# EAGLE design CAP-SENSE-SLIM (EAGLE 9.6.2)
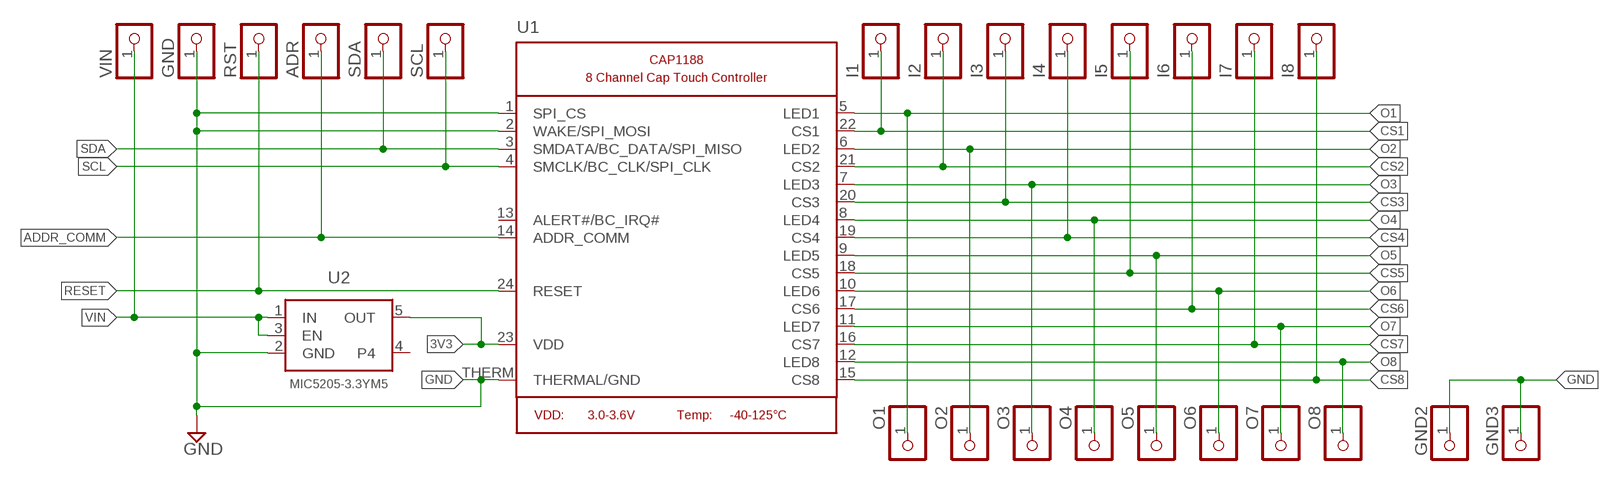
[diagram p0: schematic, sheet 1]

## Parts
ADR  PINHD-1X1CB  [1X01-CLEANBIG]
GND  PINHD-1X1CB  [1X01-CLEANBIG]
GND2  PINHD-1X1CB  [1X01-CLEANBIG]
GND3  PINHD-1X1CB  [1X01-CLEANBIG]
I1  PINHD-1X1CB  [1X01-CLEANBIG]
I2  PINHD-1X1CB  [1X01-CLEANBIG]
I3  PINHD-1X1CB  [1X01-CLEANBIG]
I4  PINHD-1X1CB  [1X01-CLEANBIG]
I5  PINHD-1X1CB  [1X01-CLEANBIG]
I6  PINHD-1X1CB  [1X01-CLEANBIG]
I7  PINHD-1X1CB  [1X01-CLEANBIG]
I8  PINHD-1X1CB  [1X01-CLEANBIG]
O1  PINHD-1X1CB  [1X01-CLEANBIG]
O2  PINHD-1X1CB  [1X01-CLEANBIG]
O3  PINHD-1X1CB  [1X01-CLEANBIG]
O4  PINHD-1X1CB  [1X01-CLEANBIG]
O5  PINHD-1X1CB  [1X01-CLEANBIG]
O6  PINHD-1X1CB  [1X01-CLEANBIG]
O7  PINHD-1X1CB  [1X01-CLEANBIG]
O8  PINHD-1X1CB  [1X01-CLEANBIG]
RST  PINHD-1X1CB  [1X01-CLEANBIG]
SCL  PINHD-1X1CB  [1X01-CLEANBIG]
SDA  PINHD-1X1CB  [1X01-CLEANBIG]
U1  MICROBUILDER_CAP1188  [MICROBUILDER_QFN24_4MM_SMSC]
U2  MIC5205-3.3YM5  MICROBUILDER_VREG_SOT23-5  [MICROBUILDER_SOT23-5]
VIN  PINHD-1X1CB  [1X01-CLEANBIG]

## Nets
3V3 [8 mil]: U1.23(VDD) U2.5(OUT)
ADDR_COMM [8 mil]: ADR.1 U1.14(ADDR_COMM)
CS1 [8 mil]: I1.1 U1.22(CS1)
CS2 [8 mil]: I2.1 U1.21(CS2)
CS3 [8 mil]: I3.1 U1.20(CS3)
CS4 [8 mil]: I4.1 U1.19(CS4)
CS5 [8 mil]: I5.1 U1.18(CS5)
CS6 [8 mil]: I6.1 U1.17(CS6)
CS7 [8 mil]: I7.1 U1.16(CS7)
CS8 [8 mil]: I8.1 U1.15(CS8)
GND [8 mil]: GND2.1 GND3.1 GND.1 U1.1(SPI_CS) U1.2(WAKE/SPI_MOSI) U1.THERM(THERMAL/GND) U2.2(GND)
O1 [8 mil]: O1.1 U1.5(LED1)
O2 [8 mil]: O2.1 U1.6(LED2)
O3 [8 mil]: O3.1 U1.7(LED3)
O4 [8 mil]: O4.1 U1.8(LED4)
O5 [8 mil]: O5.1 U1.9(LED5)
O6 [8 mil]: O6.1 U1.10(LED6)
O7 [8 mil]: O7.1 U1.11(LED7)
O8 [8 mil]: O8.1 U1.12(LED8)
RESET [8 mil]: RST.1 U1.24(RESET)
SCL [8 mil]: SCL.1 U1.4(SMCLK/BC_CLK/SPI_CLK)
SDA [8 mil]: SDA.1 U1.3(SMDATA/BC_DATA/SPI_MISO)
VIN [8 mil]: U2.1(IN) U2.3(EN) VIN.1
Unconnected: U1.13(ALERT#/BC_IRQ#) U2.4

## Library data of the parts
ADR GND GND2 GND3 I1-I8 O1-O8 RST SCL SDA VIN = adafruit:PINHD-1X1: Pin header 1x1 for 0.1" spacing With round pins
U1 = Adafruit CAP1188:MICROBUILDER_CAP1188: CAP1188 - Eight Channel Cap Touch Controller
U2 = Adafruit CAP1188:MICROBUILDER_VREG_SOT23-5: SOT23-5 Fixed Voltage Regulators Part Current Out V Out V In V Dropout θJA (°C/W) TJ (°C) Digikey Part No. ADP121 150mA 3.3V 3.4-5.5V 0.09V @ 150mA -- -- ADP121-AUJZ33R7CT-ND ADP121 150mA 3.0V 3.1-5.5V 0.09V @ 150mA -- -- ADP121-AUJZ30R7CT-ND ADP122 300mA 3.3V 3.4-5.5V 0.085V @ 300mA -- -- ADP122AUJZ-3.3-R7CT-ND ADP1712 300mA 3.3V 3.5-5.5V 0.17V @ 300mA -- -- ADP1712AUJZ-3.3-R7TR-ND AP7311 (Low Cost) 150mA 3.3V 3.5-6V 0.15V @ 150mA -- -- AP7311-33WG-7DICT-ND LD39015M18R 150mA 1.8V 1.9V-5.5V 0.08V @ 100mA -- -- 497-6977-1-ND LP2985A-33DBVR 150mA 3.3V 3.3-16V 0.28V @ 150mA 206 150 296-18479-1-ND MCP1824T-3302E/OT 300mA 3.3V 3.5V-6V 0.2V @ 300mA -- -- MCP1824T-3302E/OTCT-ND MIC5205-2.5YM5 TR 150mA 2.5V 2.7-16V 0.165V @ 150mA -- -- 576-1257-2-ND MIC5205-3.0YM5 TR 150mA 3.0V 3.2V-16V 0.165V @ 150mA -- -- 576-1258-2-ND MIC5205-3.3YM5 TR 150mA 3.3V 3.5V-16V 0.165V @ 150mA -- -- 576-1259-2-ND TPS780330220 150mA 3.3V+2.2V 3.6-5.5V 250mV Max -- -- 296-23332-1-ND TDA3663/N1,135 100mA 3.3V 3.5-45V 0.18V @ 50mA -- -- 568-5343-1-ND Max operating temp can be calculated using θJA, TJ (max junction temperature), and power in watts. Set the "Maximum Ambient Temperature" until it reaches TJ ("Max Junction Temperature"), which is the absolute limit for safe use of the regulator: Heat Sink Temperature Calculator <http://www.daycounter.com/Calculators/Heat-Sink-Temperature-Calculator.phtml> For example, With 12V source into a 3.3V LP2985 and a 30mA load, we are dissipating (12V-3.3V) * 0.03A = 0.261W. With a θJA of 206 °C/W, a TJ of 150°C, and 261mW we can safely use the chip without a heat sink up to 75°C (=147.1°C Junction Temperature).

## Net classes
1 8 mil: width 0.178 mm

## Board
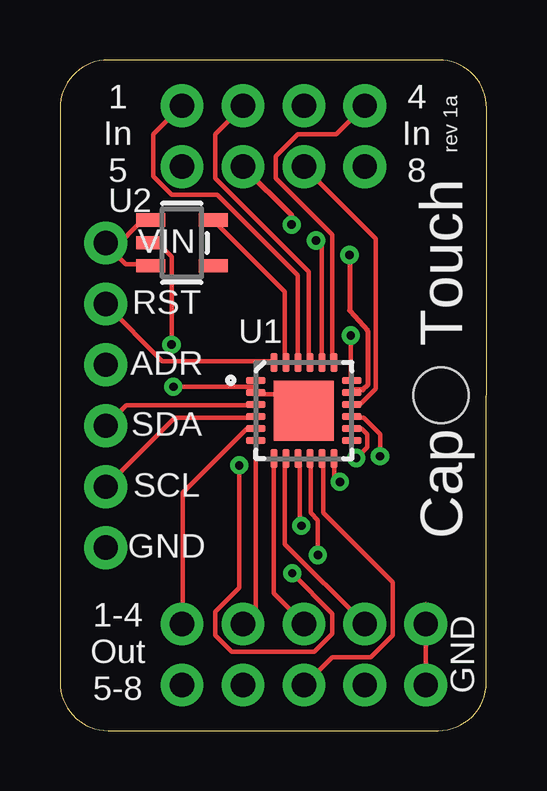
[diagram p1: board, top side]
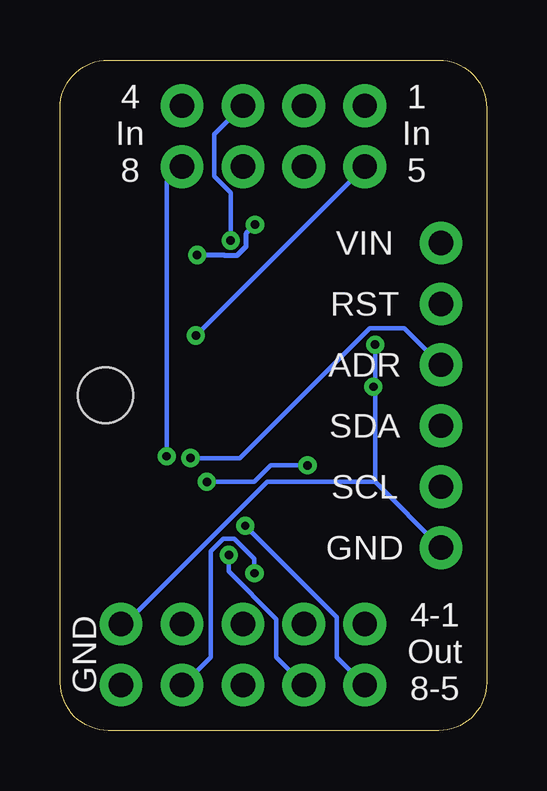
[diagram p2: board, bottom side, seen from below]

Size 17.78 x 27.94 mm. Coordinates in mm from the lower left corner, seen from the top.
Outline: 0,25.94 0,2 arc90 2,0 15.76,0 arc90 17.76,2 17.78,25.94 arc90 15.78,27.94 2,27.94 arc90 0,25.94
Copper layers (1*16): Top 0.035mm / dielectric 1.5mm / Bottom 0.035mm
Design rules "default": minimum track width 6mil, minimum drill 0.35mm, track to track 6mil, track to pad 6mil, pad to pad 6mil, via to via 6mil, smd to smd 6mil, copper to edge 40mil, drill to drill 6mil, minimum pad ring 10mil, minimum via ring 8mil, stop-mask expansion 4mil, vias tented up to drill 0mil, thermal gap 10mil
Holes 2.3 mm at 15.88,13.97

### Footprints (pad centres in the part's own frame; a part is rotated, then mirrored left to right if it is on the bottom)
1X01-CLEANBIG = drill 1.016 pad 1.778: 1 0,0
MICROBUILDER_QFN24_4MM_SMSC = smd 0.8 x 0.28: 1 -2,1.25; 2 -2,0.75; 3 -2,0.25; 4 -2,-0.25; 5 -2,-0.75; 6 -2,-1.25; 13 2,-1.25; 14 2,-0.75; 15 2,-0.25; 16 2,0.25; 17 2,0.75; 18 2,1.25 | smd 0.28 x 0.8: 7 -1.25,-2; 8 -0.75,-2; 9 -0.25,-2; 10 0.25,-2; 11 0.75,-2; 12 1.25,-2; 19 1.25,2; 20 0.75,2; 21 0.25,2; 22 -0.25,2; 23 -0.75,2; 24 -1.25,2 | smd 2.5 x 2.5: THERM 0,0
MICROBUILDER_SOT23-5 = smd 0.55 x 1.2: 1 -0.95,-1.3; 2 0,-1.3; 3 0.95,-1.3; 4 0.95,1.3; 5 -0.95,1.3

### Placement (x,y rotation side)
ADR  1.91,15.24 180 top
GND  1.91,7.62 180 top
GND2  15.24,1.91 0 top
GND3  15.24,4.45 0 top
I1  5.08,26.04 0 top
I2  7.62,26.04 0 top
I3  10.16,26.04 0 top
I4  12.7,26.04 0 top
I5  5.08,23.5 180 top
I6  7.62,23.5 180 top
I7  10.16,23.5 180 top
I8  12.7,23.5 180 top
O1  5.08,4.45 0 top
O2  7.62,4.45 0 top
O3  10.16,4.45 0 top
O4  12.7,4.45 0 top
O5  5.08,1.91 0 top
O6  7.62,1.91 0 top
O7  10.16,1.91 0 top
O8  12.7,1.91 0 top
RST  1.91,17.78 180 top
SCL  1.91,10.16 180 top
SDA  1.91,12.7 180 top
U1  10.16,13.34 0 top
U2  5.08,20.32 270 top
VIN  1.91,20.32 180 top

### Tracks (layer width: path | path; a pad name or v marks a point on that pad's centre or on a via)
3V3
  Top 0.178: U1.23 9.37,15.37 9.37,18.28 U2.5
ADDR_COMM  (via drill 0.35)
  Top 0.178: v12.34,11.35 12.8,11.81 12.8,12.34 12.57,12.57 12.19,12.57 U1.14
  Bottom 0.178: v12.34,11.35 10.29,11.35 4.88,16.76 3.43,16.76 ADR.1
CS1
  Top 0.178: I1.1 3.89,24.84 3.89,23.09 4.65,22.33 6.55,22.33 9.91,18.97 U1.22
CS2
  Top 0.178: I2.1 7.62,25.98 6.48,24.84 6.48,23.01 10.36,19.13 10.36,15.38 U1.21
CS3  (via drill 0.35)
  Top 0.178: v10.67,20.42 10.9,20.19 10.9,15.39 U1.20
  Bottom 0.178: v10.67,20.42 10.67,22.4 11.35,23.09 11.35,24.84 I3.1
CS4
  Top 0.178: I4.1 11.51,24.84 9.91,24.84 8.99,23.93 8.99,23.01 11.35,20.65 11.35,15.39 U1.19
CS5  (via drill 0.35)
  Top 0.178: v12.12,16.46 12.12,14.63 U1.18
  Bottom 0.178: I5.1 v12.12,16.46
CS6  (via drill 0.35)
  Top 0.203: I6.1 9.65,21.46 v9.65,21.08 | U1.17 12.27,14.19 12.62,14.19 12.81,14.38 12.81,16.66 12.06,17.5 v12.06,19.81
  Bottom 0.203: v12.06,19.81 10.95,19.81 10.93,19.79 10.41,19.79 10.04,20.16 10.04,20.7 v9.65,21.08
CS7
  Top 0.178: U1.16 12.21,13.64 12.56,13.64 13.16,14.24 13.16,20.5 I7.1
CS8  (via drill 0.35)
  Top 0.178: v13.34,11.43 13.34,12.34 12.65,13.03 12.19,13.03 U1.15
  Bottom 0.178: I8.1 13.34,22.86 v13.34,11.43
GND  (via drill 0.35)
  Top 0.178: 8.15,14.33 8.15,14.55 U1.1 | 8.15,14.33 U1.2 | 9.45,14.02 10.13,13.34 U1.THERM 9.37,14.02 8.31,14.02 U1.2 | 8.23,14.02 U1.2 | v4.65,16.08 4.65,19.74 4.12,20.27 3.83,20.27 U2.2 | GND2.1 GND3.1 15.24,5.26 | v4.72,14.33 8.15,14.33
  Bottom 0.178: 4.65,10.36 4.65,14.33 | 4.65,14.33 v4.65,16.08 | GND.1 4.65,10.36 | v4.72,14.33 4.65,14.33 | 4.65,10.36 9.14,10.36 15.01,4.5 15.24,4.5 GND3.1
O1
  Top 0.178: O1.1 5.11,4.47 5.11,9.91 7.77,12.57 8.15,12.57 U1.5
O2
  Top 0.178: U1.6 8.15,12.04 8.15,5.03 7.62,4.5 O2.1
O3
  Top 0.178: O3.1 10.16,4.47 8.91,5.71 U1.7
O4
  Top 0.178: O4.1 9.37,7.77 9.37,11.28 U1.8
O5  (via drill 0.35)
  Top 0.178: v10.06,8.53 9.98,8.61 9.98,11.28 U1.9
  Bottom 0.178: v10.06,8.53 6.25,4.72 6.25,3.05 5.11,1.91 O5.1
O6  (via drill 0.35)
  Top 0.178: v10.74,7.32 10.74,8.76 10.44,9.07 10.44,11.28 U1.10
  Bottom 0.178: v10.74,7.32 10.74,6.63 8.76,4.65 8.76,3.05 O6.1
O7
  Top 0.178: U1.11 10.97,11.28 10.97,9.07 13.87,6.17 13.87,3.96 12.95,3.05 11.35,3.05 10.21,1.91 O7.1
O8  (via drill 0.35)
  Top 0.178: v11.66,10.36 11.43,10.59 11.43,11.28 U1.12 | v7.47,11.05 7.47,5.94 6.48,4.95 6.48,3.96 7.16,3.28 10.59,3.28 11.35,4.04 11.35,4.88 v9.68,6.55
  Bottom 0.178: v11.66,10.36 9.68,10.36 8.99,11.05 v7.47,11.05 | v9.68,6.55 9.68,7.16 10.52,8 10.97,8 11.51,7.47 11.51,3.05 12.65,1.91 O8.1
RESET
  Top 0.178: U1.24 8.84,15.39 4.27,15.39 1.91,17.75 RST.1
SCL
  Top 0.178: U1.4 8.11,13.03 4.78,13.03 SCL.1
SDA
  Top 0.178: U1.3 8.14,13.56 2.77,13.56 SDA.1
VIN
  Top 0.178: U2.3 3.73,19.43 2.74,19.43 1.91,20.27 VIN.1 2.21,20.04 3.43,21.26 3.73,21.26 U2.1

### Text on the board
tPlace: 1 / In / 5 | 4 / In / 8 | rev 1a | Cap Touch | 1-4 / Out / 5-8 | GND
bPlace: 1 / In / 5 | 4 / In / 8 | VIN | RST | ADR | SDA | SCL | GND | 4-1 / Out / 8-5 | GND